# EasyEDA Pro project bldc-quiet-fan-easyeda.epro

# Schematic Schematic1_1
Board Name: Board1; Create Date: 2025-10-13; Page Name: P1; Project Name: spwm1pbldcfan; Schematic Name: Schematic1; Update Date: 2025-10-14; BladeWidth: 10; Company: 嘉立创EDA; Page Size: A4; RegionStart: 1; ShowBorder: 1; TitleBlock: 1; TitleBlockPosition: 3; Version: V1.0; XRegionCount: 6; YRegionCount: 4
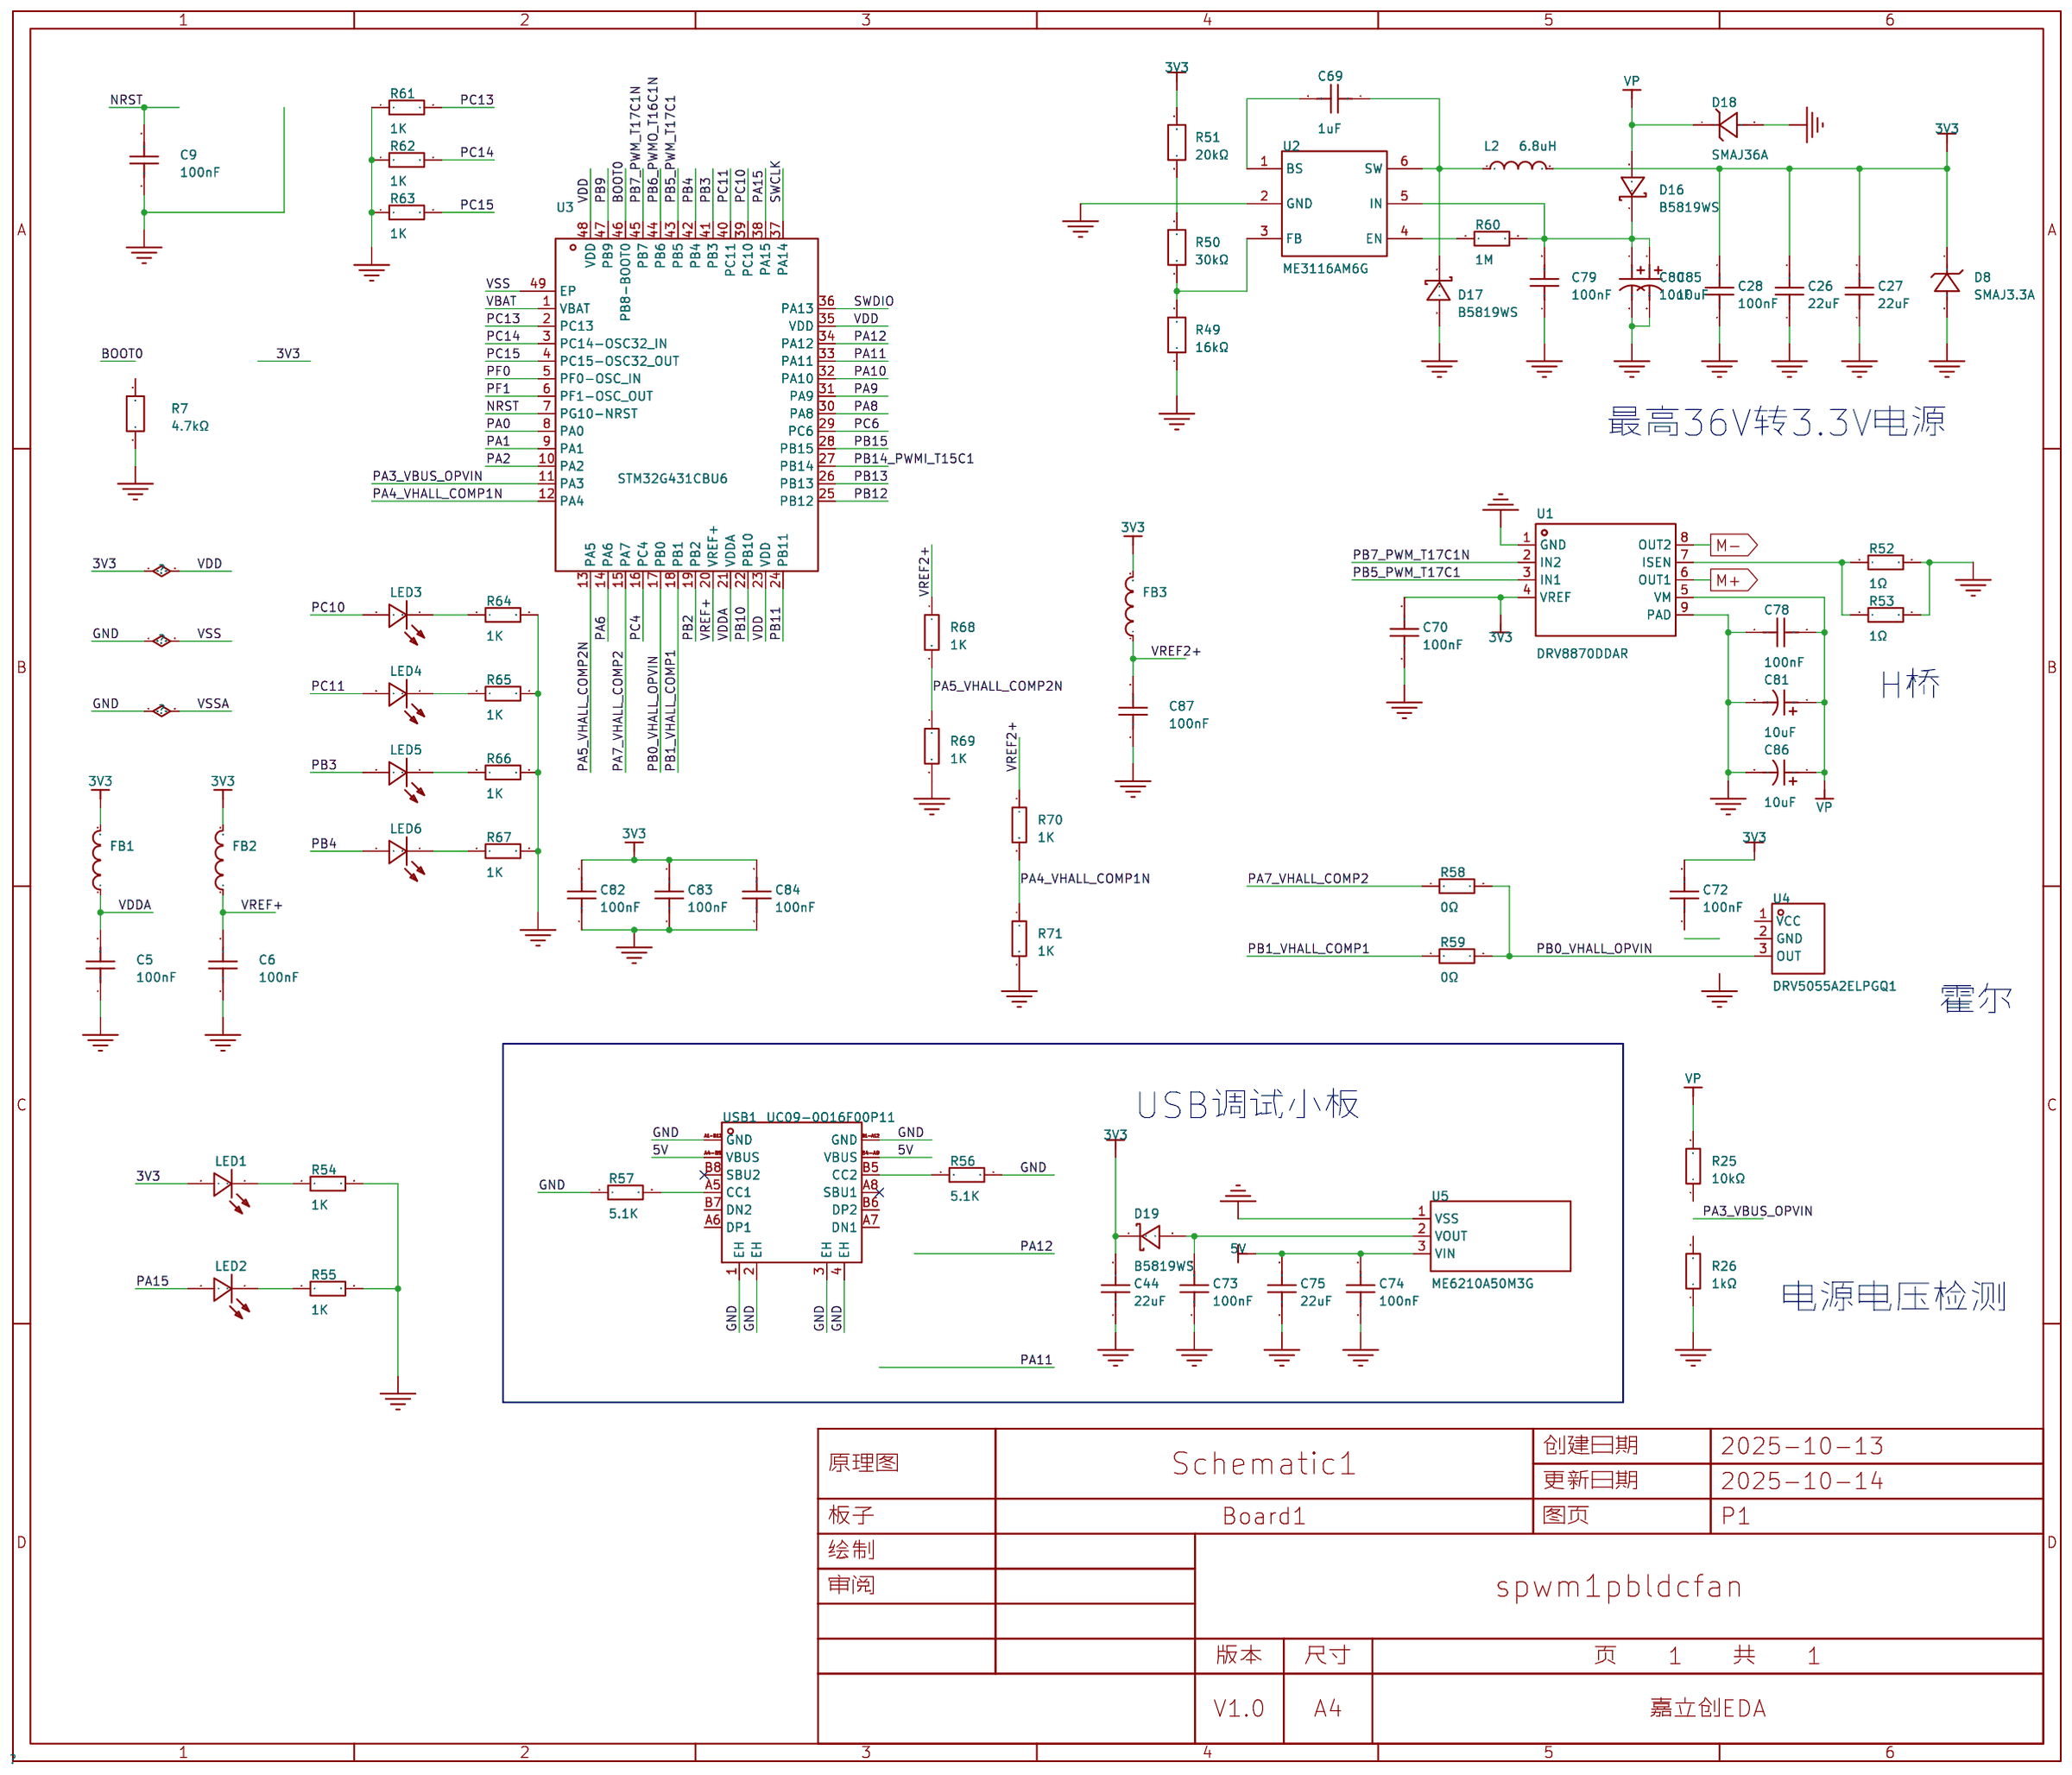
[diagram p0: schematic sheet]

## Parts
C5  100nF  [C0402]
C6  100nF  [C0402]
C9  100nF  [C0402]
C26  22uF  [C0805]
C27  22uF  [C0805]
C28  100nF  [C0402]
C44  22uF  [C0805]
C69  1uF  [C0603]
C70  100nF  [C0402]
C72  100nF  [C0402]
C73  100nF  [C0402]
C74  100nF  [C0402]
C75  22uF  [C0805]
C78  100nF  [C0603]
C79  100nF  [C0603]
C80  10uF  [C0805]
C81  10uF  [C0805]
C82  100nF  [C0402]
C83  100nF  [C0402]
C84  100nF  [C0402]
C85  10uF  [C0805]
C86  10uF  [C0805]
C87  100nF  [C0402]
D8  SMAJ3.3A  [SMA_L4.4-W2.6-LS5.0-RD]
D16  B5819WS  [SOD-323_L1.8-W1.3-LS2.5-RD]
D17  B5819WS  [SOD-323_L1.8-W1.3-LS2.5-RD]
D18  SMAJ36A  [SMA_L4.4-W2.6-LS5.0-RD]
D19  B5819WS  [SOD-323_L1.8-W1.3-LS2.5-RD]
FB1  BLM15AX601SZ1D  [L0603]
FB2  BLM15AX601SZ1D  [L0603]
FB3  BLM15AX601SZ1D  [L0603]
L2  6.8uH  [IND-SMD_L2.5-W2.0_FTC252010S]
LED1  NCD0402R1  [D0201-RD]
LED2  NCD0402R1  [D0201-RD]
LED3  NCD0402R1  [D0201-RD]
LED4  NCD0402R1  [D0201-RD]
LED5  NCD0402R1  [D0201-RD]
LED6  NCD0402R1  [D0201-RD]
R7  4.7kΩ  [R0201]
R25  10kΩ  [R0402_1]
R26  1kΩ  [R0402_1]
R49  16kΩ  [R0603]
R50  30kΩ  [R0603]
R51  20kΩ  [R0603]
R52  1Ω  [R0805]
R53  1Ω  [R0805]
R54  1K  [R0201]
R55  1K  [R0201]
R56  5.1K  [R0603]
R57  5.1K  [R0603]
R58  0Ω  [R0201]
R59  0Ω  [R0201]
R60  1M  [R0603]
R61  1K  [R0201]
R62  1K  [R0201]
R63  1K  [R0201]
R64  1K  [R0201]
R65  1K  [R0201]
R66  1K  [R0201]
R67  1K  [R0201]
R68  1K  [R0201]
R69  1K  [R0201]
R70  1K  [R0201]
R71  1K  [R0201]
U1  DRV8870DDAR  [HSOP-8_L5.0-W4.0-P1.27-LS6.2-BL-EP]
U2  ME3116AM6G  [SOT-23-6_L2.9-W1.6-P0.95-LS2.8-BL]
U3  STM32G431CBU6  [UFQFPN-48_L7.0-W7.0-P0.50-BL-EP]
U4  DRV5055A2ELPGQ1  [TO-92S-3_L4.0-W1.5-P1.27-L]
U5  ME6210A50M3G  [SOT-23-3_L2.9-W1.6-P1.90-LS2.8-BR]
USB1  UC09-0O16F00P11  [USB-C-SMD_UC09-0O16F00P11]

## Library data of the parts
C5 C6 C9 C28 C70 C72-C74 C82-C84 C87 = CL05B104KB54PNC: LCSC Part Name: 100nF ±10% 50V; Supplier Part: C307331; Manufacturer: SAMSUNG(三星); Supplier Footprint: 0402; JLCPCB Part Class: Basic Part; Datasheet: https://item.szlcsc.com/datasheet/CL05B104KB54PNC/291005.html; Supplier: LCSC; Tolerance: ±10%; Voltage Rating: 50V; Temperature Coefficient: X7R
C26 C27 C44 C75 = CGA0805X5R226M250MT: LCSC Part Name: 22uF ±20% 25V; Supplier Part: C6119899; Manufacturer: HRE(芯声); Supplier Footprint: 0805; JLCPCB Part Class: 扩展库; Supplier: LCSC; Tolerance: ±20%; Voltage Rating: 25V; Temperature Coefficient: X5R
C69 = CL10A105KB8NNNC: 容值:1uF;精度:±10%;额定电压:50V;温度系数:X5R;; LCSC Part Name: 1uF ±10% 50V; Supplier Part: C15849; Manufacturer: SAMSUNG(三星); Supplier Footprint: 0603; JLCPCB Part Class: Basic Part; Datasheet: https://item.szlcsc.com/datasheet/CL10A105KB8NNNC/16531.html; Supplier: LCSC; Tolerance: ±10%; Voltage Rating: 50V; Temperature Coefficient: X5R
C78 C79 = CGA0603X7R104K500JT: 容值:100nF;精度:±10%;额定电压:50V;温度系数:X7R;; LCSC Part Name: 100nF ±10% 50V; Supplier Part: C6119867; Manufacturer: HRE(芯声); Supplier Footprint: 0603; JLCPCB Part Class: Extended Part; Datasheet: https://item.szlcsc.com/datasheet/CGA0603X7R104K500JT/7062573.html; Supplier: LCSC; Tolerance: ±10%; Voltage Rating: 50V; Temperature Coefficient: X7R
C80 C81 C85 C86 = CL21A106KBYQNNE: LCSC Part Name: 10uF ±10% 50V; Supplier Part: C2932476; Manufacturer: SAMSUNG(三星); Supplier Footprint: 0805; JLCPCB Part Class: Extended Part; Datasheet: https://item.szlcsc.com/datasheet/CL21A106KBYQNNE/3277789.html; Supplier: LCSC; Tolerance: ±10%; Voltage Rating: 50V; Temperature Coefficient: X5R
D8 = SMAJ3.3A_C50325421: 极性:单向;反向截止电压(Vrwm):3.3V;钳位电压:8V;峰值脉冲电流(Ipp):43.8A;峰值脉冲功率(Ppp):400W;击穿电压:5.2V;; Supplier Part: C50325421; Manufacturer: R+O(宏嘉诚); Supplier Footprint: SMA; JLCPCB Part Class: Extended Part; Datasheet: https://item.szlcsc.com/datasheet/SMAJ3.3A/52920632.html; Supplier: LCSC; Polarity: 单向; Reverse Stand-Off Voltage (Vrwm): 3.3V; Clamping Voltage: 8V; Peak Pulse Current (Ipp): 43.8A; Peak Pulse Power Dissipation (Ppp): 400W; Voltage - Breakdown: 5.2V; Reverse Leakage Current (Ir): 600uA; Number of Channels: 单路; Operating Temperature: -55℃~+150℃; Type: TVS; Check: false
D16 D17 D19 = B5819WS_C22624: LCSC Part Name: 电压:40V 电流:1A; Supplier Part: C22624; Manufacturer: CJ(江苏长电/长晶); Supplier Footprint: SOD-323; JLCPCB Part Class: 扩展库; Datasheet: https://atta.szlcsc.com/upload/public/pdf/source/20150407/1457707273359.pdf; Supplier: LCSC; Forward Voltage (Vf@If): 600mV@1A; Reverse Voltage (Vr): 40V; Average Rectified Current (Io): 1A
D18 = SMAJ36A_C19077550: 极性:单向;反向截止电压(Vrwm):36V;钳位电压:58.1V;峰值脉冲电流(Ipp):6.9A@10/1000us;峰值脉冲功率(Ppp):400W@10/1000us;击穿电压:44.2V;; LCSC Part Name: 单向TVS 36V截止 峰值浪涌电流：6.9A@10/1000us; Supplier Part: C19077550; Manufacturer: R+O(宏嘉诚); Supplier Footprint: DO-214AC(SMA); JLCPCB Part Class: Extended Part; Datasheet: https://item.szlcsc.com/datasheet/SMAJ36A/20275635.html; Supplier: LCSC; Polarity: 单向; Reverse Stand-Off Voltage (Vrwm): 36V; Clamping Voltage: 58.1V; Peak Pulse Current (Ipp): 6.9A@10/1000us; Peak Pulse Power Dissipation (Ppp): 400W@10/1000us; Voltage - Breakdown: 44.2V; Reverse Leakage Current (Ir): 1uA; Number of Channels: 单路; Operating Temperature: -55℃~+150℃; level of protection: IEC 61000-4-2; Type: TVS; Check: false
FB1-FB3 = BLM15AX601SZ1D: 阻抗@频率:600Ω@100MHz;误差:±25%;直流电阻(DCR):340mΩ;; LCSC Part Name: 单路 0402磁珠 阻抗600Ω@100MHz; Supplier Part: C710330; Manufacturer: muRata(村田); Supplier Footprint: 0402; JLCPCB Part Class: Extended Part; Datasheet: https://item.szlcsc.com/datasheet/BLM15AX601SZ1D/748702.html; Supplier: LCSC; Impedance @ Frequency: 600Ω@100MHz; Tolerance: ±25%; DC Resistance(DCR): 340mΩ; Current Rating: 500mA; Number of Circuits: 1; Operating Temperature: -55℃~+125℃; Check: false
L2 = FTC252012S6R8MBCA: LCSC Part Name: 6.8uH ±20% 2A; Supplier Part: C5832375; Manufacturer: cjiang(长江微电); Supplier Footprint: SMD,2x2.5mm; JLCPCB Part Class: 扩展库; Datasheet: https://atta.szlcsc.com/upload/public/pdf/source/20230602/8FFEDA9C0247A92A0D4B67554BFE4091.pdf; Supplier: LCSC; Tolerance: ±20%; Rated Current: 1.6A; Saturation Current (Isat): 2A; DC Resistance (DCR): 245mΩ; Type: 一体成型电感
LED1-LED6 = NCD0402R1: 灯头类型:-;发光颜色:红色;正向压降(Vf):1.6V~2.6V;功率:65mW;正向电流:25mA;波长:615nm~635nm;二极管配置:独立二极管;透镜颜色:-;色温:-;发光强度:30mcd;发光角度:130°;载带方式:-;工作温度:-30℃~+85℃;; LCSC Part Name: 片式发光二极管; Supplier Part: C130719; Manufacturer: 国星光电; Supplier Footprint: 0402; JLCPCB Part Class: Extended Part; Datasheet: https://item.szlcsc.com/datasheet/NCD0402R1/142008.html; Supplier: LCSC; Illumination Color: 红色; Voltage - Forward(Vf): 1.6V~2.6V; Power(Watts): 65mW; Forward Current: 25mA; Wavelength - Dominant: 615nm~635nm; Peak Wavelength: 630nm; Diode Configuration: 独立二极管; Luminous Intensity: 30mcd; Viewing Angle: 130°; Operating Temperature: -30℃~+85℃; Check: false
R7 = FRC0402F1802TS: LCSC Part Name: 18kΩ ±1% 62.5mW 厚膜电阻; Supplier Part: C2909327; Manufacturer: FOJAN(富捷); Supplier Footprint: 0402; JLCPCB Part Class: 扩展库; Datasheet: https://atta.szlcsc.com/upload/public/pdf/source/20211221/925EC7D7225764EE0046F22065062C87.pdf; Supplier: LCSC; Type: 厚膜电阻; Tolerance: ±1%; Power(Watts): 62.5mW; Voltage-Supply(Max): 50V; Temperature Coefficient: ±100ppm/℃; Operating Temperature: -55℃~+155℃
R25 = 0402WGJ0512TCE: LCSC Part Name: 5.1kΩ ±5%; Supplier Part: C25941; Manufacturer: UNI-ROYAL(厚声); Supplier Footprint: 0402; JLCPCB Part Class: Extended Part; Datasheet: https://atta.szlcsc.com/upload/public/pdf/source/20200306/C422600_1E6D84923E4A46A82E41ADD87F860B5C.pdf; Supplier: LCSC; Type: 厚膜电阻; Tolerance: ±5%; Power(Watts): 1/16W; Temperature Coefficient: ±100ppm/℃; Overload Voltage (Max): 50V; Operating Temperature Range: -55℃~+155℃
R26 = 0402WGJ0102TCE: 电阻类型:厚膜电阻;阻值:1kΩ;精度:±5%;功率:62.5mW;工作电压:50V;温度系数:±100ppm/℃;; LCSC Part Name: 1kΩ ±5% 62.5mW 厚膜电阻; Supplier Part: C25543; Manufacturer: UNI-ROYAL(厚声); Supplier Footprint: 0402; JLCPCB Part Class: Extended Part; Datasheet: https://item.szlcsc.com/datasheet/0402WGJ0102TCE/26286.html; Supplier: LCSC; Type: 厚膜电阻; Tolerance: ±5%; Power(Watts): 62.5mW; Voltage-Supply(Max): 50V; Temperature Coefficient: ±100ppm/℃; Operating Temperature: -55℃~+155℃; Check: false
R49-R51 = RC0603JR-10100KL: LCSC Part Name: 厚膜电阻 100kΩ ±5% 100mW; Supplier Part: C2076431; Manufacturer: YAGEO(国巨); Supplier Footprint: 0603; JLCPCB Part Class: 扩展库; Datasheet: https://atta.szlcsc.com/upload/public/pdf/source/20210709/C2076431_C527E83D8EBCDA16EDF042122F720957.pdf; Supplier: LCSC; Type: 厚膜电阻; Tolerance: ±5%; Power(Watts): 100mW; Overload Voltage (Max): 75V; Temperature Coefficient: ±100ppm/℃; Operating Temperature Range: -55℃~+155℃
R52 R53 = Res_0805: Supplier Footprint: 0805
R54 R55 R58 R59 R61-R71 = Res_0201: Supplier Footprint: 0201
R56 R57 R60 = Res_0603: Supplier Footprint: 0603
U1 = DRV8870DDAR: LCSC Part Name: 刷式直流电机驱动器（PWM控制）; Supplier Part: C86590; Manufacturer: TI(德州仪器); Supplier Footprint: HSOP-8-EP; JLCPCB Part Class: 扩展库; Datasheet: https://www.ti.com/cn/lit/gpn/drv8870; Supplier: LCSC; Peak Current: 3.6A; RDS(on): 565mΩ; Operating Temperature: -40℃~+125℃
U2 = ME3116AM6G_C97643: LCSC Part Name: 最高输入40V带载可达1A的DC/DC降压型稳压器; Supplier Part: C97643; Manufacturer: MICRONE(南京微盟); Supplier Footprint: SOT-23-6; JLCPCB Part Class: 扩展库; Datasheet: https://atta.szlcsc.com/upload/public/pdf/source/20170322/1490151692992.pdf; Supplier: LCSC; Function: 降压型; Voltage - Supply: 4.75V~40V; Output Current: 1A; Frequency - Switching: 550kHz; Operating Temperature: -40℃~+125℃@(TJ); Synchronous Rectifier: 否; Number of Outputs: 1; Topology: 降压式; Switch tube (built-in/external): 内置
U3 = STM32G431CBU6: LCSC Part Name: 带DSP和FPU的170MHz主流ARM Cortex-M4 MCU，具有128 KB Flash存储器、数学加速器和中等模拟电平集成; Supplier Part: C529356; Manufacturer: ST(意法半导体); Supplier Footprint: UFQFPN-48(7x7); JLCPCB Part Class: 扩展库; Datasheet: https://atta.szlcsc.com/upload/public/pdf/source/20200511/C529354_7C66CF00837B904D0C15DCE45B69418C.pdf; Supplier: LCSC; CPU Core: ARM-M系列; CPU Maximum Speed: 170MHz; Program Storage Size: 128KB; Program Memory Type: FLASH; Number of I/O: 42; ADC (Bit): 12bit; DAC (Bit): 12bit; Low Voltage Detection Threshold: 1.71V~3.6V; Check: false
U4 = DRV5055A2ELPGQ1: LCSC Part Name: 线性霍尔效应传感器; Supplier Part: C1559893; Manufacturer: TI(德州仪器); Supplier Footprint: TO-92; JLCPCB Part Class: 扩展库; Datasheet: https://www.ti.com/cn/lit/gpn/drv5055-q1; Supplier: LCSC; supply voltage: 3V~3.63V；4.5V~5.5V; Operating Temperature: -40℃~+150℃
U5 = ME6210A50M3G: LCSC Part Name: 输入18V 输出5V 500mA; Supplier Part: C236679; Manufacturer: MICRONE(南京微盟); Supplier Footprint: SOT-23; JLCPCB Part Class: 扩展库; Datasheet: https://atta.szlcsc.com/upload/public/pdf/source/20190709/C403652_164B03470289BC6E2EF0FCF22B47472A.pdf; Supplier: LCSC; Output Type: 固定; Voltage - Supply: 18V; Output Voltage: 5V; Output Current: 500mA; Voltage Dropout: 220mV@(200mA); Features: 短路保护(SCP)；低ESR; Output Configuration: 正极; Number of Outputs: 1
USB1 = UC09-0O16F00P11: LCSC Part Name: USB Type-C 母座 卧贴; Supplier Part: C36936541; Manufacturer: BXCONN(宝讯); Supplier Footprint: SMD; JLCPCB Part Class: 扩展库; Datasheet: https://atta.szlcsc.com/upload/public/pdf/source/20240731/591155F6664C57552DC307035301A7C8.pdf; Supplier: LCSC; Connector Type: Type-C; Gender: 母; Mounting Type: 卧贴; Number of Contacts: 16P; Number of Ports: 1; Current Rating-Power: 3A

## Nets
3V3: C26.2 C27.2 C28.2 C44.2 C70.2 C72.2 C82.2 C83.2 C84.2 D8.1(C) D19.1(K) FB1.2 FB2.2 FB3.2 L2.2 LED1.2(A) R51.2 U1.4(VREF) U3.23(VDD) U3.35(VDD) U3.48(VDD) U4.1(VCC)
5V: C74.2 C75.2 U5.3(VIN) USB1.A4-B9(VBUS) USB1.B4-A9(VBUS)
GND: C5.1 C6.1 C9.1 C26.1 C27.1 C28.1 C44.1 C70.1 C72.1 C73.1 C74.1 C75.1 C78.1 C79.1 C80.2 C81.2 C82.1 C83.1 C84.1 C85.2 C86.2 C87.1 D8.2(A) D17.2(A) D18.2(A) R7.1 R26.1 R49.1 R52.2 R53.2 R54.2 R55.2 R56.2 R57.1 R61.1 R62.1 R63.1 R64.2 R65.2 R66.2 R67.2 R69.2 R71.2 U1.1(GND) U1.9(PAD) U2.2(GND) U3.49(EP) U4.2(GND) U5.1(VSS) USB1.1(EH) USB1.2(EH) USB1.3(EH) USB1.4(EH) USB1.A1-B12(GND) USB1.B1-A12(GND)
VBAT: U3.1(VBAT)
VDDA: C5.2 FB1.1 U3.21(VDDA)
BOOT0: R7.2 U3.46(PB8-BOOT0)
M+: U1.6(OUT1)
M-: U1.8(OUT2)
NRST: C9.2 U3.7(PG10-NRST)
PA0: U3.8(PA0)
PA1: U3.9(PA1)
PA2: U3.10(PA2)
PA3_VBUS_OPVIN: R25.1 R26.2 U3.11(PA3)
PA4_VHALL_COMP1N: R70.2 R71.1 U3.12(PA4)
PA5_VHALL_COMP2N: R68.2 R69.1 U3.13(PA5)
PA6: U3.14(PA6)
PA7_VHALL_COMP2: R58.1 U3.15(PA7)
PA8: U3.30(PA8)
PA9: U3.31(PA9)
PA10: U3.32(PA10)
PA11: U3.33(PA11) USB1.A7(DN1) USB1.B7(DN2)
PA12: U3.34(PA12) USB1.A6(DP1) USB1.B6(DP2)
PA15: LED2.2(A) U3.38(PA15)
PB0_VHALL_OPVIN: R58.2 R59.2 U3.17(PB0) U4.3(OUT)
PB1_VHALL_COMP1: R59.1 U3.18(PB1)
PB2: U3.19(PB2)
PB3: LED5.2(A) U3.41(PB3)
PB4: LED6.2(A) U3.42(PB4)
PB5_PWM_T17C1: U1.3(IN1) U3.43(PB5)
PB6_PWMO_T16C1N: U3.44(PB6)
PB7_PWM_T17C1N: U1.2(IN2) U3.45(PB7)
PB9: U3.47(PB9)
PB10: U3.22(PB10)
PB11: U3.24(PB11)
PB12: U3.25(PB12)
PB13: U3.26(PB13)
PB14_PWMI_T15C1: U3.27(PB14)
PB15: U3.28(PB15)
PC4: U3.16(PC4)
PC6: U3.29(PC6)
PC10: LED3.2(A) U3.39(PC10)
PC11: LED4.2(A) U3.40(PC11)
PC13: R61.2 U3.2(PC13)
PC14: R62.2 U3.3(PC14-OSC32_IN)
PC15: R63.2 U3.4(PC15-OSC32_OUT)
PF0: U3.5(PF0-OSC_IN)
PF1: U3.6(PF1-OSC_OUT)
SWCLK: U3.37(PA14)
SWDIO: U3.36(PA13)
VP: C78.2 C81.1 C86.1 D16.2(A) D18.1(K) R25.2 U1.5(VM)
VREF2+: C87.2 FB3.1 R68.1 R70.1
VREF+: C6.2 FB2.1 U3.20(VREF+)
$1N1116: C69.1 D17.1(K) L2.1 U2.6(SW)
$1N1117: C79.2 C80.1 C85.1 D16.1(K) R60.2 U2.5(IN)
$1N1118: R60.1 U2.4(EN)
$1N1125: C69.2 U2.1(BS)
$1N1129: R49.2 R50.1 U2.3(FB)
$1N1598: R50.2 R51.1
$1N1844: LED2.1(K) R55.1
$1N1845: LED1.1(K) R54.1
$1N2051: R52.1 R53.1 U1.7(ISEN)
$1N3116: R56.1 USB1.B5(CC2)
$1N3117: R57.2 USB1.A5(CC1)
$1N4991: C73.2 D19.2(A) U5.2(VOUT)
$1N6662: LED3.1(K) R64.1
$1N6728: LED4.1(K) R65.1
$1N6794: LED5.1(K) R66.1
$1N6860: LED6.1(K) R67.1

Not connected (* = marked no-connect by the designer): USB1 A8(SBU1)* B8(SBU2)*

## Notes on the sheet
- 最高36V转3.3V电源
- H桥
- 霍尔
- USB调试小板
- 电源电压检测

# Board PCB1_1
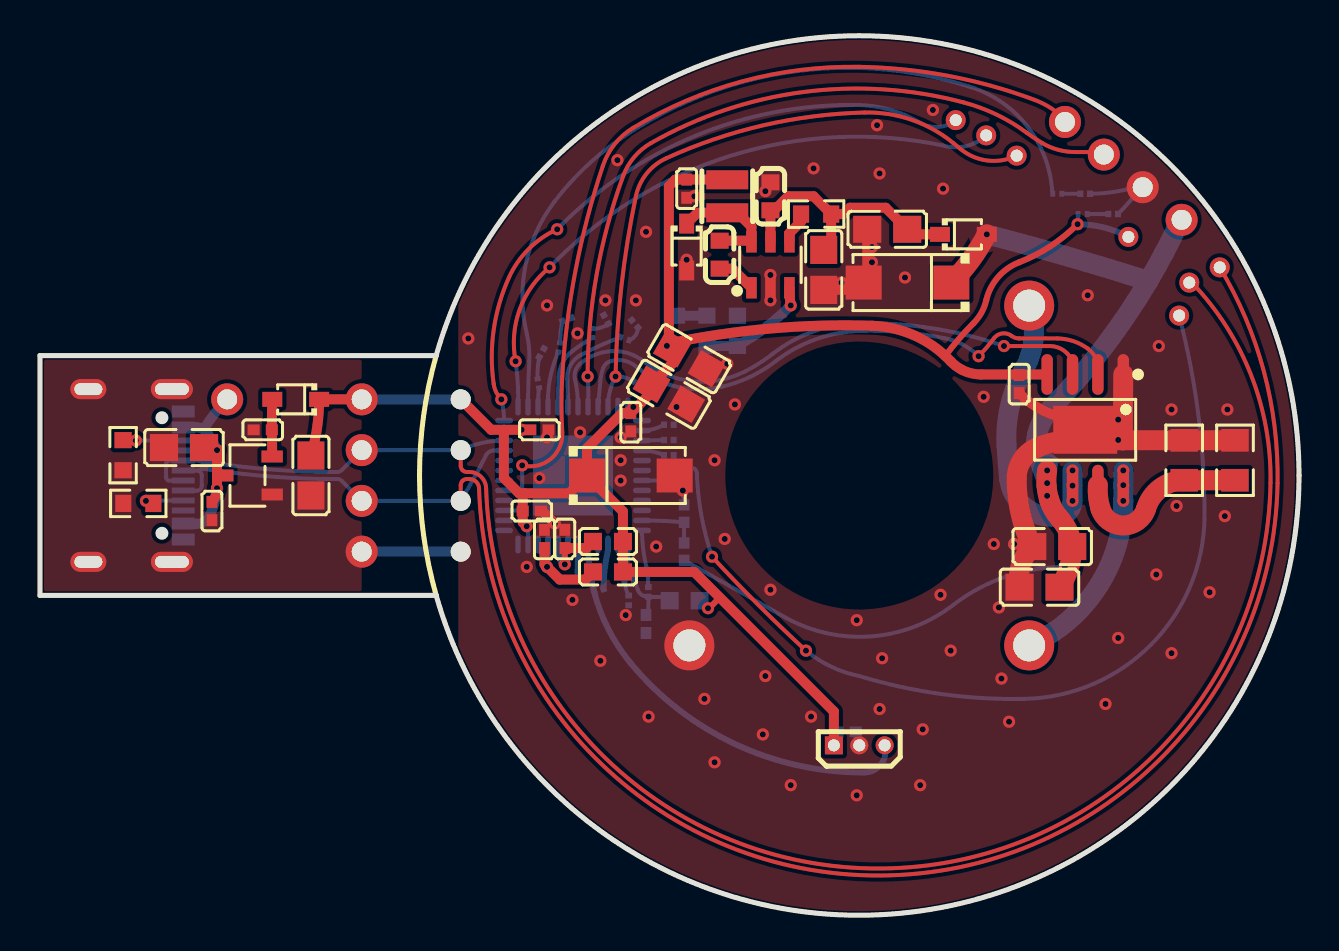
[diagram p1: board, top side]
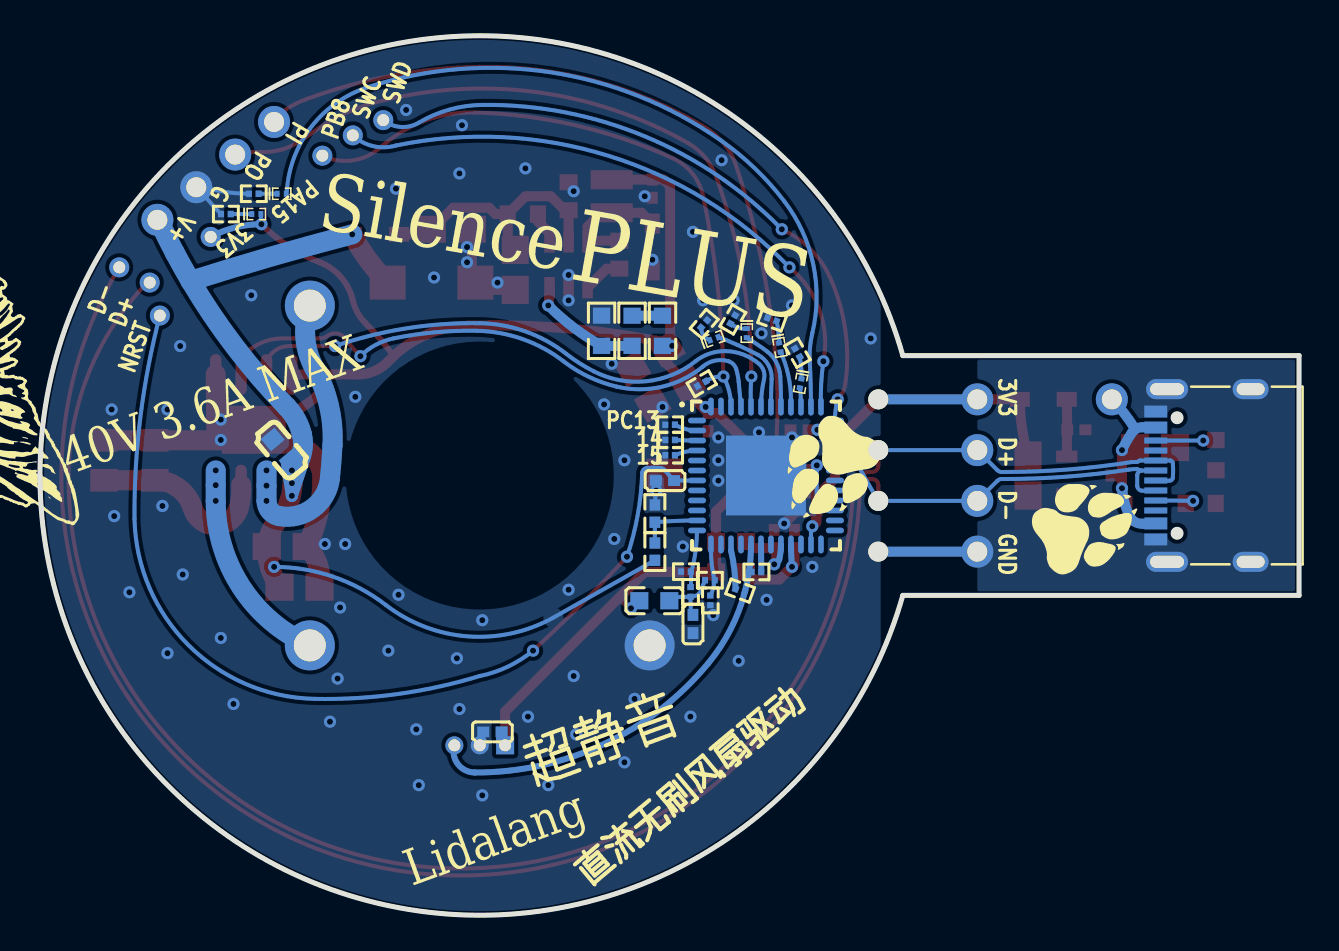
[diagram p2: board, bottom side, seen from below]

Outline 62.99 x 44 mm; copper layers: Top Layer, Bottom Layer. Coordinates in mm from the lower left corner of the outline.
Outline path: 0,28 19.82,28 arc(44.02,43.79) 62.99,22 arc(44.02,0.21) 19.82,16 0,16 0,28
Stack: Top Layer 0.035mm / Dielectric1 1.51mm FR4 er 4.5 / Bottom Layer 0.035mm

## Design rules (mm)
net PA11: DP2
net PA12: DP2
spacing copperThickness1oz (default): track to track 0.102, other pairs 0.152 to 0.3
spacing copperThickness2oz: track to track 0.203, other pairs 0.152 to 0.3
spacing Plane_innerPlane: track to track 0.102, other pairs 0.152 to 0.3
spacing Copper_copperRegion: track to track 0.102, other pairs 0.152 to 0.3
track width copperThickness1oz (default): min 0.127, default 0.254, max 2.54
track width copperThickness2oz: min 0.203, default 0.254, max 2.54
differential pair differentialPair (default): width min 0.127, default 0.254, max 2.54; gap min 0.152, default 0.152
pour e465 uses Copper_copperRegion
pour e471 uses Copper_copperRegion

## Placement (name value [footprint] x y rotation side)
C5  100nF  [C0402]  25.24 18.82 270 top
C6  100nF  [C0402]  26.26 18.82 270 top
C9  100nF  [C0402]  31.72 21.75 180 bottom
C26  22uF  [C0805]  32.48 27.84 150 top
C27  22uF  [C0805]  31.46 26.06 150 top
C28  100nF  [C0402]  32.35 36.35 90 top
C44  22uF  [C0805]  13.56 22 90 top
C69  1uF  [C0603]  34 33.05 270 top
C70  100nF  [C0402]  48.99 26.57 90 top
C72  100nF  [C0402]  40.35 9.17 180 bottom
C73  100nF  [C0402]  11.14 24.29 0 top
C74  100nF  [C0402]  8.6 20.22 90 top
C75  22uF  [C0805]  7.21 23.4 0 top
C78  100nF  [C0603]  50.89 23.27 230 bottom
C79  100nF  [C0603]  36.54 35.97 270 top
C80  10uF  [C0805]  39.21 32.29 270 top
C81  10uF  [C0805]  50.64 18.44 180 top
C82  100nF  [C0402]  29.56 24.67 90 top
C83  100nF  [C0402]  24.6 20.22 180 top
C84  100nF  [C0402]  24.99 24.29 180 top
C85  10uF  [C0805]  42.38 34.32 180 top
C86  10uF  [C0805]  50 16.41 180 top
C87  100nF  [C0402]  30.32 14.57 90 bottom
D8  SMAJ3.3A  [SMA_L4.4-W2.6-LS5.0-RD]  29.56 22 0 top
D16  B5819WS  [SOD-323_L1.8-W1.3-LS2.5-RD]  46.19 34.06 0 top
D17  B5819WS  [SOD-323_L1.8-W1.3-LS2.5-RD]  32.35 33.43 270 top
D18  SMAJ36A  [SMA_L4.4-W2.6-LS5.0-RD]  43.4 31.65 180 top
D19  B5819WS  [SOD-323_L1.8-W1.3-LS2.5-RD]  12.79 25.81 180 top
FB1  BLM15AX601SZ1D  [L0603]  28.41 17.17 0 top
FB2  BLM15AX601SZ1D  [L0603]  28.41 18.7 0 top
FB3  BLM15AX601SZ1D  [L0603]  32.25 15.73 0 bottom
L2  6.8uH  [IND-SMD_L2.5-W2.0_FTC252010S]  34.38 35.97 90 top
LED1  NCD0402R1  [D0201-RD]  52.16 35.08 180 bottom
LED2  NCD0402R1  [D0201-RD]  50.89 36.1 180 bottom
LED3  NCD0402R1  [D0201-RD]  24.93 26.61 280 bottom
LED4  NCD0402R1  [D0201-RD]  25.97 28.41 260 bottom
LED5  NCD0402R1  [D0201-RD]  27.63 29.12 270 bottom
LED6  NCD0402R1  [D0201-RD]  29.26 28.84 160 bottom
NOREF  -  [Pad_e131]  9.37 25.81 270 top
NOREF#2  -  [Pad_e125]  47.34 39.02 320 top
NOREF#3  -  [Pad_e111]  49.49 30.5 0 top
NOREF#4  -  [Pad_e123]  57.11 34.79 320 top
NOREF#5  -  [Pad_e120]  51.28 39.69 320 top
NOREF#6  -  [Pad_e114]  57.5 31.65 320 top
NOREF#7  -  [Pad_e113]  56.99 30 320 top
NOREF#8  -  [Pad_e130]  21.05 18.19 270 top
NOREF#9  -  [Pad_e129]  21.05 20.73 270 top
NOREF#10  -  [Pad_e115]  59.02 32.41 320 top
NOREF#11  -  [Pad_e127]  21.05 25.81 270 top
NOREF#12  -  [Pad_e116]  16.1 25.81 270 top
NOREF#13  -  [Pad_e112]  32.49 13.5 0 top
NOREF#14  -  [Pad_e118]  16.1 20.73 270 top
NOREF#15  -  [Pad_e121]  53.22 38.06 320 top
NOREF#16  -  [Pad_e124]  48.86 38 320 top
NOREF#17  -  [Pad_e128]  21.05 23.27 270 top
NOREF#18  -  [Pad_e126]  45.81 39.78 320 top
NOREF#19  -  [Pad_e110]  49.49 13.5 0 top
NOREF#20  -  [Pad_e117]  16.1 23.27 270 top
NOREF#21  -  [Pad_e132]  54.45 33.94 320 top
NOREF#22  -  [Pad_e119]  16.1 18.19 270 top
NOREF#23  -  [Pad_e122]  55.17 36.42 320 top
R7  4.7kΩ  [R0201]  29.88 26.59 150 bottom
R25  10kΩ  [R0402_1]  32.22 18.19 270 bottom
R26  1kΩ  [R0402_1]  32.22 20.09 270 bottom
R49  16kΩ  [R0603]  34.89 29.24 270 bottom
R50  30kΩ  [R0603]  33.37 29.24 90 bottom
R51  20kΩ  [R0603]  31.84 29.24 270 bottom
R52  1Ω  [R0805]  57.24 22.76 90 top
R53  1Ω  [R0805]  59.78 22.76 90 top
R54  1K  [R0201]  53.69 35.08 0 bottom
R55  1K  [R0201]  52.29 36.1 0 bottom
R56  5.1K  [R0603]  4.16 23.02 270 top
R57  5.1K  [R0603]  4.92 20.6 0 top
R58  0Ω  [R0201]  27.96 16.24 200 bottom
R59  0Ω  [R0201]  27.15 17.17 0 bottom
R60  1M  [R0603]  38.83 35.08 0 top
R61  1K  [R0201]  31.46 24.54 180 bottom
R62  1K  [R0201]  31.46 23.78 180 bottom
R63  1K  [R0201]  31.46 23.02 180 bottom
R64  1K  [R0201]  25.1 28.14 60 bottom
R65  1K  [R0201]  26.36 29.81 20 bottom
R66  1K  [R0201]  28.32 29.81 120 bottom
R67  1K  [R0201]  29.76 29.59 130 bottom
R68  1K  [R0201]  29.48 16.76 180 bottom
R69  1K  [R0201]  29.45 15.75 270 bottom
R70  1K  [R0201]  30.44 16.18 90 bottom
R71  1K  [R0201]  30.67 17.19 0 bottom
U1  DRV8870DDAR  [HSOP-8_L5.0-W4.0-P1.27-LS6.2-BL-EP]  52.29 24.29 180 top
U2  ME3116AM6G  [SOT-23-6_L2.9-W1.6-P0.95-LS2.8-BL]  36.54 32.54 0 top
U3  STM32G431CBU6  [UFQFPN-48_L7.0-W7.0-P0.50-BL-EP]  26.67 22 270 bottom
U4  DRV5055A2ELPGQ1  [TO-92S-3_L4.0-W1.5-P1.27-L]  40.99 8.5 0 top
U5  ME6210A50M3G  [SOT-23-3_L2.9-W1.6-P1.90-LS2.8-BR]  10.38 22 0 top
USB1  UC09-0O16F00P11  [USB-C-SMD_UC09-0O16F00P11]  4.79 22 90 bottom

## Footprints (pads in the part's own frame, mm; a bottom-side part is the same pattern mirrored in y, then rotated)
C0402
  rect 0.6x0.54 smd: 1(-0.456,0) 2(0.456,0)
C0603
  rect 0.8x0.9 smd: 1(-0.7,0) 2(0.7,0)
C0805
  rect 1.41x1.35 smd: 1(-1,0) 2(1,0)
D0201-RD
  rect 0.243x0.3 smd: 1(-0.227,0) 2(0.227,0)
HSOP-8_L5.0-W4.0-P1.27-LS6.2-BL-EP
  oval 0.574x2.038 smd: 1(-1.905,-2.769) 2(-0.635,-2.769) 3(0.635,-2.769) 4(1.905,-2.769) 5(1.905,2.769) 6(0.635,2.769) 7(-0.635,2.769) 8(-1.905,2.769)
  rect 3.2x2.4 smd: 9(0,0)
IND-SMD_L2.5-W2.0_FTC252010S
  rect 0.95x2.1 smd: 1(-0.825,0) 2(0.825,0)
L0603
  rect 0.9x0.864 smd: 1(-0.75,0) 2(0.75,0)
Pad_e110
  round 2.5 hole 1.6: 1(0,0)
Pad_e111
  round 2.5 hole 1.6: 1(0,0)
Pad_e112
  round 2.5 hole 1.6: 1(0,0)
Pad_e113
  round 1 hole 0.6: 1(0,0)
Pad_e114
  round 1 hole 0.6: 1(0,0)
Pad_e115
  round 1 hole 0.6: 1(0,0)
Pad_e116
  round 1.6 hole 1: 1(0,0)
Pad_e117
  round 1.6 hole 1: 1(0,0)
Pad_e118
  round 1.6 hole 1: 1(0,0)
Pad_e119
  round 1.6 hole 1: 1(0,0)
Pad_e120
  round 1.6 hole 1: 1(0,0)
Pad_e121
  round 1.6 hole 1: 1(0,0)
Pad_e122
  round 1.6 hole 1: 1(0,0)
Pad_e123
  round 1.6 hole 1: 1(0,0)
Pad_e124
  round 1 hole 0.6: 1(0,0)
Pad_e125
  round 1 hole 0.6: 1(0,0)
Pad_e126
  round 1 hole 0.6: 1(0,0)
Pad_e127
  round 1 hole 1x0.6: 1(0,0)
Pad_e128
  round 1 hole 1x0.6: 1(0,0)
Pad_e129
  round 1 hole 1x0.6: 1(0,0)
Pad_e130
  round 1 hole 1x0.6: 1(0,0)
Pad_e131
  round 1.6 hole 1: 1(0,0)
Pad_e132
  round 1 hole 0.6: 1(0,0)
R0201
  rect 0.303x0.324 smd: 1(-0.241,0) 2(0.241,0)
R0402_1
  rect 0.566x0.54 smd: 1(-0.433,0) 2(0.433,0)
R0603
  rect 0.806x0.864 smd: 1(-0.753,0) 2(0.753,0)
R0805
  rect 1.133x1.377 smd: 1(-1,0) 2(1,0)
SMA_L4.4-W2.6-LS5.0-RD
  rect 1.8x1.7 smd: 1(-2.192,0) 2(2.192,0)
SOD-323_L1.8-W1.3-LS2.5-RD
  rect 1x0.75 smd: 1(-1.173,0) 2(1.173,0)
SOT-23-3_L2.9-W1.6-P1.90-LS2.8-BR
  rect 1.07x0.6 smd: 1(1.235,-0.95) 2(1.235,0.95) 3(-1.235,0)
SOT-23-6_L2.9-W1.6-P0.95-LS2.8-BL
  rect 0.532x1.072 smd: 1(-0.95,-1.149) 2(0,-1.149) 3(0.95,-1.149) 4(0.95,1.149) 5(0,1.149) 6(-0.95,1.149)
TO-92S-3_L4.0-W1.5-P1.27-L
  rect 0.9x0.9 hole 0.6: 1(-1.27,0)
  round 0.9 hole 0.6: 2(0,0) 3(1.27,0)
UFQFPN-48_L7.0-W7.0-P0.50-BL-EP
  oval 0.28x0.9 smd: 1(-2.751,-3.45) 2(-2.251,-3.45) 3(-1.75,-3.45) 4(-1.25,-3.45) 5(-0.749,-3.45) 6(-0.249,-3.45) 7(0.249,-3.45) 8(0.75,-3.45) 9(1.25,-3.45) 10(1.75,-3.45) 11(2.251,-3.45) 12(2.751,-3.45) 25(2.751,3.449) 26(2.251,3.449) 27(1.75,3.449) 28(1.25,3.449) 29(0.75,3.449) 30(0.249,3.449) 31(-0.249,3.449) 32(-0.749,3.449) 33(-1.25,3.449) 34(-1.75,3.449) 35(-2.251,3.449) 36(-2.751,3.449)
  oval 0.9x0.28 smd: 13(3.45,-2.751) 14(3.45,-2.251) 15(3.45,-1.75) 16(3.45,-1.25) 17(3.45,-0.75) 18(3.45,-0.249) 19(3.45,0.249) 20(3.45,0.749) 21(3.45,1.25) 22(3.45,1.75) 23(3.45,2.251) 24(3.45,2.751) 37(-3.449,2.751) 38(-3.449,2.251) 39(-3.449,1.75) 40(-3.449,1.25) 41(-3.449,0.749) 42(-3.449,0.249) 43(-3.449,-0.249) 44(-3.449,-0.75) 45(-3.449,-1.25) 46(-3.449,-1.75) 47(-3.449,-2.251) 48(-3.449,-2.751)
  rect 4x4 smd: 49(0,0)
USB-C-SMD_UC09-0O16F00P11
  oval 1x2.1 hole 0.6x1.7: 1(-4.32,1.808) 4(4.32,1.808)
  oval 1x1.8 hole 0.6x1.4: 2(-4.32,-2.373) 3(4.32,-2.373)
  rect 0.6x1.15 smd: A1-B12(-3.2,2.373) A4-B9(-2.4,2.373) B1-A12(3.2,2.373) B4-A9(2.4,2.373)
  rect 0.3x1.15 smd: A5(-1.25,2.373) A6(-0.25,2.373) A7(0.25,2.373) A8(1.25,2.373) B5(1.75,2.373) B6(0.75,2.373) B7(-0.75,2.373) B8(-1.75,2.373)

## Nets
3V3: C26.2 C27.2 C28.2 C44.2 C70.2 C72.2 C82.2 C83.2 C84.2 D8.1 D19.1 FB1.2 FB2.2 FB3.2 L2.2 LED1.2 NOREF#11.1 NOREF#12.1 NOREF#21.1 R51.2 U1.4 U3.23 U3.35 U3.48 U4.1
5V: C74.2 C75.2 NOREF.1 U5.3 USB1.A4-B9 USB1.B4-A9
GND: C5.1 C6.1 C9.1 C26.1 C27.1 C28.1 C44.1 C70.1 C72.1 C73.1 C74.1 C75.1 C78.1 C79.1 C80.2 C81.2 C82.1 C83.1 C84.1 C85.2 C86.2 C87.1 D8.2 D17.2 D18.2 NOREF#8.1 NOREF#13.1 NOREF#22.1 NOREF#23.1 R7.1 R26.1 R49.1 R52.2 R53.2 R54.2 R55.2 R56.2 R57.1 R61.1 R62.1 R63.1 R64.2 R65.2 R66.2 R67.2 R69.2 R71.2 U1.1 U1.9 U2.2 U3.49 U4.2 U5.1 USB1.1 USB1.2 USB1.3 USB1.4 USB1.A1-B12 USB1.B1-A12
VBAT: U3.1
VDDA: C5.2 FB1.1 U3.21
BOOT0: NOREF#16.1 R7.2 U3.46
M+: NOREF#3.1 U1.6
M-: NOREF#19.1 U1.8
NRST: C9.2 NOREF#7.1 U3.7
PA0: U3.8
PA1: U3.9
PA2: U3.10
PA3_VBUS_OPVIN: R25.1 R26.2 U3.11
PA4_VHALL_COMP1N: R70.2 R71.1 U3.12
PA5_VHALL_COMP2N: R68.2 R69.1 U3.13
PA6: U3.14
PA7_VHALL_COMP2: R58.1 U3.15
PA8: U3.30
PA9: U3.31
PA10: U3.32
PA11: NOREF#9.1 NOREF#10.1 NOREF#14.1 U3.33 USB1.A7 USB1.B7
PA12: NOREF#6.1 NOREF#17.1 NOREF#20.1 U3.34 USB1.A6 USB1.B6
PA15: LED2.2 U3.38
PB0_VHALL_OPVIN: R58.2 R59.2 U3.17 U4.3
PB1_VHALL_COMP1: R59.1 U3.18
PB2: U3.19
PB3: LED5.2 U3.41
PB4: LED6.2 U3.42
PB5_PWM_T17C1: U1.3 U3.43
PB6_PWMO_T16C1N: NOREF#15.1 U3.44
PB7_PWM_T17C1N: U1.2 U3.45
PB9: U3.47
PB10: U3.22
PB11: U3.24
PB12: U3.25
PB13: U3.26
PB14_PWMI_T15C1: NOREF#5.1 U3.27
PB15: U3.28
PC4: U3.16
PC6: U3.29
PC10: LED3.2 U3.39
PC11: LED4.2 U3.40
PC13: R61.2 U3.2
PC14: R62.2 U3.3
PC15: R63.2 U3.4
PF0: U3.5
PF1: U3.6
SWCLK: NOREF#2.1 U3.37
SWDIO: NOREF#18.1 U3.36
VP: C78.2 C81.1 C86.1 D16.2 D18.1 NOREF#4.1 R25.2 U1.5
VREF2+: C87.2 FB3.1 R68.1 R70.1
VREF+: C6.2 FB2.1 U3.20
$1N1116: C69.1 D17.1 L2.1 U2.6
$1N1117: C79.2 C80.1 C85.1 D16.1 R60.2 U2.5
$1N1118: R60.1 U2.4
$1N1125: C69.2 U2.1
$1N1129: R49.2 R50.1 U2.3
$1N1598: R50.2 R51.1
$1N1844: LED2.1 R55.1
$1N1845: LED1.1 R54.1
$1N2051: R52.1 R53.1 U1.7
$1N3116: R56.1 USB1.B5
$1N3117: R57.2 USB1.A5
$1N4991: C73.2 D19.2 U5.2
$1N6662: LED3.1 R64.1
$1N6728: LED4.1 R65.1
$1N6794: LED5.1 R66.1
$1N6860: LED6.1 R67.1

Pads without a net: USB1 A8 B8

## Via types
v1: diameter 0.61, hole 0.305, Top Layer to Bottom Layer, 109 vias

## Routing (per net, layer and track width the routed paths; a pad name or vN(x,y) marks a point on that pad's centre or on a via; arc(x,y) is an arc through that point)
3V3: length 98.7
  Top Layer w0.3: 33.56,15.44 arc(33.78,15.66) 33.99,15.89 ; 45.29,27.98 arc(45.97,28.83) 46.7,29.62 arc(47.1,30.15) 47.34,30.76 arc(47.93,31.92) 48.99,32.67 arc(50.55,33.47) v1(51.91,34.57)
  Top Layer w0.5: v1(24.35,19.46) 24.15,19.66 C83.2 24.15,21.04 24.22,21.11 ; D8.1 26.48,21.11 24.22,21.11 ; D8.1 27.37,23.36 29.12,25.12 C82.2 30.6,26.16 C27.2 31.61,27.58 C26.2 ; D8.1 29.16,20.2 FB2.2 FB1.2 ; L2.2 34.37,36.81 C28.2 31.79,36.81 31.46,36.48 31.46,28.6 arc(36.52,29.35) 41.62,29.49 arc(43.59,29.07) 45.29,27.98 arc(45.43,27.85) 45.56,27.72 arc(45.82,27.48) 46.11,27.3 arc(46.58,27.12) 47.08,27.06 U1.4 ; 24.22,21.11 23.97,21.11 23.21,21.87 23.21,24.29 ; NOREF#11.1 22.57,24.29 23.21,24.29 ; v1(24.1,24.29) 23.21,24.29 ; 29.3,17.17 32.73,17.17 39.72,10.19 U4.1 ; NOREF#12.1 D19.1 arc(13.86,24.39) C44.2
  Bottom Layer w0.2: v1(24.35,19.46) 24.42,19.4 U3.23 ; LED1.2 arc(51.93,34.83) v1(51.91,34.57)
  Bottom Layer w0.3: 39.9,9.17 arc(39.85,8.83) U4.1 ; U3.35 arc(23.66,24.26) v1(24.1,24.29) ; 33.01,15.68 arc(33.28,15.58) 33.42,15.33 ; v1(51.91,34.57) arc(53.22,34.41) NOREF#21.1
  Bottom Layer w0.5: NOREF#12.1 NOREF#11.1
  vias: v1(29.69,25.43) v1(31.36,28.49) v1(33.42,15.36)
5V: length 9.8
  Top Layer w0.5: v1(8.86,23.27) v1(8.86,21.36) arc(8.79,21) C74.2
  Bottom Layer w0.5: NOREF.1 arc(8.73,25.1) 8.2,24.31 ; 8.2,24.31 arc(8.03,24.39) 7.84,24.41 arc(7.5,24.4) USB1.B4-A9 ; 8.2,24.31 arc(8.28,24.24) 8.35,24.16 arc(8.62,23.73) v1(8.86,23.27) ; v1(8.86,21.37) arc(8.73,20.65) 8.48,19.97 arc(8.22,19.68) 7.84,19.59 arc(7.5,19.6) USB1.A4-B9
GND: length 40.5
  Top Layer w0.5: C80.2 40.84,31.29 D18.2 41.38,31.83 C85.2 ; C83.1 25.13,20.22 v1(25.76,19.6) ; C70.1 arc(50.28,25.21) 51.79,24.79
  Top Layer w1: R53.2 R52.2 54.17,23.76 ; 54.17,23.76 52.81,23.76 52.79,23.79 ; 54.17,23.76 U1.1 ; 51.79,23.79 arc(50.81,23.69) 49.88,23.4 arc(49.14,22.79) 48.86,21.87 arc(48.97,20.53) 49.31,19.23 arc(49.46,18.83) C81.2 arc(49.07,17.51) C86.2
  Bottom Layer w0.2: R26.1 arc(32.2,20.89) 32.18,21.25 arc(32.18,21.5) C9.1 ; R54.2 arc(54.58,35.79) 55.17,36.55 arc(53.87,36.21) R55.2
  Bottom Layer w0.3: C72.1 arc(40.85,8.82) U4.2
  Bottom Layer w0.5: NOREF#22.1 NOREF#8.1
  vias: v1(21.43,28.86) v1(24.35,17.43) v1(24.99,21.87) v1(25.37,30.51) v1(25.37,23.9) v1(26.64,15.78) v1(26.89,29.11) v1(27.02,24.16) v1(28.03,12.73) v1(28.29,30.76) v1(28.89,37.78) v1(29.05,23.9) v1(29.05,22.76) v1(29.05,21.75) v1(29.3,15.01) v1(29.81,30.76) v1(30.32,34.19) v1(30.45,9.93) v1(30.83,18.44) v1(31.84,25.43) v1(32.16,21.25) v1(32.35,32.79) v1(32.73,35.97) v1(33.24,10.82) v1(33.75,22.76) v1(33.75,7.65) v1(34.26,18.82) v1(34.38,27.59) v1(34.76,25.56) v1(36.16,9.05) v1(36.29,36.22) v1(36.29,11.97) v1(36.54,32.03) v1(36.54,30.76) v1(36.54,16.28) v1(37.56,6.51) v1(38.57,9.93) v1(38.7,37.37) v1(40.1,31.65) v1(40.86,14.76) v1(40.86,6) v1(41.62,33.43) v1(41.62,32.67) v1(41.88,39.53) v1(42,37.11) v1(42,10.32) v1(42.13,12.86) v1(43.27,31.91) v1(44.04,6.51) v1(44.16,9.3) v1(44.67,40.29) v1(45.05,16.03) v1(45.18,36.35) v1(45.56,13.24) v1(47.21,25.94) v1(47.72,18.57) v1(47.97,15.4) v1(48.1,11.84) v1(48.48,9.68) v1(48.74,18.57) v1(52.42,31.02) v1(53.31,10.57) v1(53.94,24.79) v1(53.94,23.78) v1(53.94,13.87) v1(55.85,17.05) v1(55.97,28.48) v1(56.61,25.3) v1(56.61,13.11) v1(56.86,20.48) v1(58.51,16.16) v1(59.28,19.97) v1(59.4,25.3)
VDDA: length 4.8
  Top Layer w0.5: C5.2 25.24,17.56 26,16.79 27.28,16.79 FB1.1
  Bottom Layer w0.3: U3.21 arc(25.4,17.99) v1(25.37,17.43)
BOOT0: length 32.9
  Top Layer w0.2: 48.62,37.76 NOREF#16.1 arc(47.41,37.76) 46.06,38.33 45.69,38.64 arc(43.6,39.8) 41.24,40.16 arc(36.17,39.52) 31.34,37.88 arc(30.35,37.1) 29.81,35.97 arc(29.09,31.49) v1(28.8,26.95)
  Bottom Layer w0.2: 28.8,26.97 arc(29.25,26.9) 29.67,26.72 ; 28.42,25.45 arc(28.51,26.22) v1(28.8,26.95)
M+: length 15.1
  Bottom Layer w1: v1(51.66,22.25) v1(51.66,21.49) v1(51.66,20.73) arc(51.48,20.23) 51.02,19.97 arc(49.33,20.37) 48.48,21.87 arc(48.41,22.7) 48.35,23.52 arc(48.53,25.49) 49.24,27.33 arc(49.71,28.89) NOREF#3.1
M-: length 10.7
  Bottom Layer w1: v1(54.2,22.25) v1(54.2,21.52) v1(54.2,20.73) arc(52.92,16.42) NOREF#19.1
NRST: length 49.8
  Top Layer w0.2: v1(33.62,17.94) arc(35.92,15.54) v1(38.32,13.24)
  Bottom Layer w0.2: U3.7 31.26,21.75 arc(31.5,21.99) 31.72,22.25 arc(31.83,22.35) 31.97,22.38 arc(32.29,22.39) 32.61,22.38 arc(32.78,22.3) 32.86,22.13 arc(33.09,20) v1(33.62,17.94) ; v1(38.32,13.24) arc(39.58,12.44) 40.99,11.97 arc(45.07,11.07) 49.24,10.82 arc(55.57,13.52) 58.26,19.84 arc(57.96,24.96) NOREF#7.1
PA3_VBUS_OPVIN: length 3.1
  Bottom Layer w0.2: R25.1 R26.2 arc(31.17,19.73) U3.11
PA4_VHALL_COMP1N: length 2.8
  Bottom Layer w0.2: 30.42,16.45 arc(30.42,16.82) 30.41,17.18 ; 30.4,17.19 arc(30.19,18.21) 30.12,19.26
PA5_VHALL_COMP2N: length 2.2
  Bottom Layer w0.2: 29.26,16.73 arc(29.31,16.36) 29.44,16.01 ; 29.42,18.23 arc(29.38,17.53) 29.26,16.83
PA7_VHALL_COMP2: length 1.9
  Bottom Layer w0.3: 28.19,16.32 arc(28.25,17.29) 28.41,18.24
PA11: length 95.2
  Top Layer w0.2: NOREF#9.1 21.05,21.52 arc(21.07,21.63) 21.14,21.73 arc(21.24,21.8) 21.36,21.82 21.48,21.82 arc(21.82,21.69) 21.97,21.35 arc(42.07,1.99) 61.91,21.61 arc(61.23,27.22) NOREF#10.1
  Bottom Layer w0.2: 7.89,22.25 7.94,22.25 arc(7.99,22.26) 8.03,22.29 arc(8.07,22.31) 8.12,22.32 ; 7.89,22.25 USB1.A7 ; 7.89,22.25 arc(8.04,22.16) 8.09,22 8.09,21.49 arc(8.02,21.31) 7.84,21.24 arc(7.5,21.24) USB1.B7 ; U3.33 22.7,23.25 arc(22.48,23.19) 22.32,23.02 arc(21.7,21.86) NOREF#9.1 NOREF#14.1 15.09,21.73 arc(14.99,21.8) 14.88,21.82 14.75,21.82 arc(11.63,21.94) 8.52,22.29 arc(8.32,22.32) 8.12,22.32
PA12: length 93.7
  Top Layer w0.2: NOREF#17.1 21.05,22.48 arc(21.07,22.37) 21.14,22.27 arc(21.24,22.2) 21.36,22.18 21.48,22.18 arc(22.06,21.94) 22.32,21.37 arc(42.06,2.34) 61.56,21.62 arc(60.59,27.03) 57.62,31.65
  Bottom Layer w0.2: USB1.A6 arc(6.81,21.73) 6.44,21.75 arc(6.36,21.79) 6.32,21.87 arc(6.3,22.25) 6.32,22.64 arc(6.36,22.72) 6.44,22.75 USB1.B6 7.94,22.75 arc(7.99,22.74) 8.03,22.71 arc(8.07,22.69) 8.12,22.68 8.32,22.68 arc(8.35,22.68) 8.38,22.67 arc(11.55,22.3) 14.75,22.18 14.88,22.18 arc(14.99,22.2) 15.09,22.27 NOREF#20.1 NOREF#17.1 arc(22.11,23.63) U3.34
PA15: length 40.6
  Bottom Layer w0.2: 24.42,25.45 arc(24.43,26.58) 24.48,27.72 arc(24.47,28.42) 24.35,29.11 arc(24.3,32.57) 25.75,35.72 arc(27.22,37.36) 28.92,38.76 arc(37.44,42.17) 46.58,41.43 arc(49.41,39.45) 50.64,36.22
PB0_VHALL_OPVIN: length 21.7
  Bottom Layer w0.3: U3.17 arc(27.44,17.87) 27.52,17.19 arc(27.6,16.68) 27.72,16.18 arc(28.45,14.29) 29.56,12.6 arc(34.79,8.56) 41.24,7.14 arc(42.09,7.57) U4.3
PB1_VHALL_COMP1: length 1.4
  Bottom Layer w0.3: U3.18 arc(26.91,17.86) R59.1
PB3: length 3.9
  Bottom Layer w0.2: 25.92,25.76 arc(25.93,26.36) 25.95,26.96 arc(26.15,27.66) 26.62,28.21 arc(27.13,28.58) 27.67,28.91
PB4: length 5
  Bottom Layer w0.2: 26.42,25.45 arc(26.41,26.14) 26.38,26.83 arc(26.55,27.53) 27.07,28.04 arc(28.05,28.51) 29.05,28.93
PB5_PWM_T17C1: length 29.2
  Top Layer w0.2: v1(48.23,28.48) 50.51,28.48 arc(51,28.38) 51.4,28.1 arc(51.67,27.61) U1.3
  Bottom Layer w0.2: v1(48.23,28.48) arc(44.66,29.36) 40.99,29.62 arc(38.7,29.21) 36.67,28.1 arc(35.99,27.62) 35.27,27.21 arc(32.66,26.72) 30.19,27.71 arc(29.48,28.1) 28.67,28.22 arc(27.79,28.05) 27.02,27.59 arc(26.79,27.24) 26.76,26.83 arc(26.88,26.14) 26.92,25.45
PB6_PWMO_T16C1N: length 37.7
  Top Layer w0.2: 53.22,38.18 51.78,38.18 arc(50.93,38.3) 50.13,38.64 arc(49.74,38.88) 49.37,39.14 arc(47.85,40.06) 46.19,40.67 arc(38.19,41.19) 30.57,38.64 arc(29.73,37.94) 29.18,36.99 arc(27.85,32.05) v1(27.4,26.95)
  Bottom Layer w0.2: 27.42,25.45 arc(27.43,26.2) v1(27.4,26.95)
PB7_PWM_T17C1N: length 29.8
  Top Layer w0.2: U1.2 arc(52.86,27.78) 52.42,28.35 arc(51.7,28.72) 50.89,28.86 arc(49.94,28.86) 48.99,28.86 arc(48.79,28.89) 48.61,28.98 arc(48.14,29.11) 47.72,28.86 arc(47.36,28.4) v1(46.96,27.97)
  Bottom Layer w0.2: 27.92,25.45 28.03,26.7 arc(28.08,27.02) 28.16,27.33 arc(28.3,27.57) 28.54,27.71 arc(29.21,27.75) 29.81,27.46 arc(31.85,26.44) 34.13,26.44 arc(35.53,26.94) 36.8,27.71 arc(38.83,28.82) 41.12,29.24 arc(43.22,29.17) 45.31,28.86 arc(46.2,28.53) v1(46.96,27.97)
PB14_PWMI_T15C1: length 44.7
  Top Layer w0.2: 51.28,39.82 arc(50.57,40.39) 49.75,40.8 arc(45.44,41.99) 40.99,42.45 arc(35.12,41.72) 29.69,39.4 arc(28.75,38.58) 28.16,37.49 arc(26.8,32.29) 26.13,26.95 arc(26.09,25.56) 26.13,24.16 arc(25.55,22.82) v1(24.12,22.51)
  Bottom Layer w0.2: U3.27 23.87,20.25 24.12,20.5 v1(24.12,22.51)
PC10: length 0.6
  Bottom Layer w0.2: 24.92,25.77 arc(24.94,26.08) 24.97,26.39
PC11: length 2.5
  Bottom Layer w0.2: 25.41,25.75 arc(25.55,27) 25.93,28.18
PC13: length 1.2
  Bottom Layer w0.2: U3.2 arc(30.69,24.32) R61.2
PC14: length 1.1
  Bottom Layer w0.2: U3.3 arc(30.67,23.76) R62.2
PC15: length 1.1
  Bottom Layer w0.2: U3.4 arc(30.68,23.19) R63.2
SWCLK: length 31.3
  Top Layer w0.2: v1(23.79,27.71) arc(24,30.3) v1(25.49,32.41)
  Bottom Layer w0.2: NOREF#2.1 arc(46.33,38.48) 45.18,38.51 arc(34.55,38) v1(25.49,32.41) ; 23.92,25.45 arc(23.91,26.59) v1(23.79,27.72)
SWDIO: length 32.8
  Top Layer w0.2: v1(23.08,25.81) arc(22.83,26.16) 22.7,26.57 arc(22.7,29.29) 23.46,31.91 arc(24.45,33.33) v1(25.88,34.32)
  Bottom Layer w0.2: v1(25.88,34.32) arc(32.73,38.97) 40.86,40.54 arc(42.51,40.31) 44.04,39.65 arc(44.94,39.44) NOREF#18.1 ; 23.22,24.75 arc(23.18,25.29) v1(23.08,25.81)
VP: length 57.2
  Top Layer w1: v1(50.39,22.25) arc(50.35,21.87) 50.36,21.49 arc(50.41,21.12) 50.5,20.76 arc(50.71,20.27) 51.02,19.84 arc(51.44,19.19) C81.1 arc(51.6,17.9) 51.47,17.36 arc(51.27,16.87) C86.1 ; D18.1 arc(46.57,32.79) v1(47.37,34.06)
  Bottom Layer w0.2: R25.2 37.31,14.89 arc(41.59,13.95) 45.69,15.52 arc(48.32,16.94) v1(51.28,17.43)
  Bottom Layer w0.6: 49.75,22.89 v1(50.39,20.98) 50.64,22.63
  Bottom Layer w1: v1(50.39,22.25) arc(50.26,22.39) 50.15,22.54 arc(49.86,23.26) 49.88,24.03 arc(50.16,24.78) 50.64,25.43 arc(53.23,28.44) 55.45,31.73 ; 55.45,31.73 arc(55.85,32.42) 56.23,33.11 arc(56.68,34.01) 57.11,34.92 ; 55.45,31.73 arc(51.43,32.95) v1(47.37,34.06)
  vias: v1(50.39,21.62)
VREF2+: length 2.8
  Bottom Layer w0.2: 31.37,15.91 arc(30.91,15.93) 30.44,15.93 arc(30.44,15.55) 30.42,15.16 ; 30.36,15.95 arc(30.08,16.04) 29.91,16.29 arc(29.81,16.54) 29.67,16.77
VREF+: length 3.5
  Top Layer w0.3: v1(26.26,17.55) C6.2
  Top Layer w0.5: C6.2 27.34,18.37 FB2.1
  Bottom Layer w0.3: U3.20 arc(25.94,18.18) 26,17.81 arc(26.09,17.65) v1(26.26,17.55)
$1N1116: length 6.1
  Top Layer w0.5: D17.1 32.89,35.15 L2.1 34.89,35.15 35.59,34.45 35.59,33.69 35.53,33.75 34,33.75
$1N1117: length 13.3
  Top Layer w0.5: R60.2 39.58,35.09 38.7,35.97 37.43,35.97 36.54,35.08 ; R60.2 39.58,33.66 C80.1 ; R60.2 40.2,35.08 40.51,35.4 42.31,35.4 C85.1 43.64,34.07 D16.1 ; U2.5 36.54,35.08 ; 36.54,35.08 36.54,35.14
$1N1118: length 1.6
  Top Layer w0.5: R60.1 38.08,34.71 37.49,34.13 U2.4
$1N1125: length 2
  Top Layer w0.5: C69.2 34.64,32.35 35.59,31.39
$1N1129: length 5.6
  Top Layer w0.5: U2.3 arc(37.51,30.95) v1(37.56,30.51)
  Bottom Layer w0.5: R50.1 34.76,28.48 ; v1(37.56,30.51) arc(36.29,29.41) R49.2
$1N1598: length 1.5
  Bottom Layer w0.5: R50.2 R51.1
$1N1844: length 0.9
  Bottom Layer w0.2: LED2.1 R55.1
$1N1845: length 1.1
  Bottom Layer w0.2: LED1.1 R54.1
$1N2051: length 9.3
  Top Layer w1: R53.1 R52.1 arc(56.06,21.37) 55.34,20.35 arc(54.2,19.5) 53.05,20.35 arc(52.94,20.93) U1.7
$1N3116: length 3
  Top Layer w0.2: v1(4.79,23.75) arc(4.48,23.75) R56.1
  Bottom Layer w0.2: USB1.B5 v1(4.79,23.75)
$1N3117: length 2.3
  Top Layer w0.2: v1(5.3,20.73) arc(5.5,20.7) R57.2
  Bottom Layer w0.2: USB1.A5 arc(6.23,20.74) v1(5.3,20.73)
$1N4991: length 2.9
  Top Layer w0.5: D19.2 arc(11.6,25.05) C73.2 arc(11.61,23.62) U5.2
$1N6662: length 1.1
  Bottom Layer w0.2: 24.88,26.87 arc(24.91,27.41) 24.98,27.93
$1N6728: length 1.1
  Bottom Layer w0.2: 26.02,28.63 arc(26.05,29.18) 26.13,29.72
$1N6794: length 0.8
  Bottom Layer w0.2: 27.66,29.33 arc(28.07,29.4) 28.45,29.6
$1N6860: length 0.8
  Bottom Layer w0.2: 29.91,29.4 arc(29.79,29.01) LED6.1

## Copper pours and planes (outline as drawn; the poured copper is in the pictures)
GND on Top Layer: -2.15,45.51 64.68,45.51 64.68,-2.24 -2.15,-2.24
GND on Bottom Layer: -7.87,49.19 69.81,49.19 69.81,-6.01 -7.87,-6.01

## Text on the board
Bottom Silkscreen Layer: 14 | 15 | PC13 | 3V3 | D+ | D- | GND | PI | PO | G | V+ | PA15 | SWD | SWC | PB8 | NRST | Lidalang | 40V 3.6A MAX | Silence | PLUS | 直流无刷风扇驱动 | 超静音
